# Altium schematic sheet ControlPlateSTM32.SchDoc
size A4; SheetNumber: 1; SheetTotal: 1
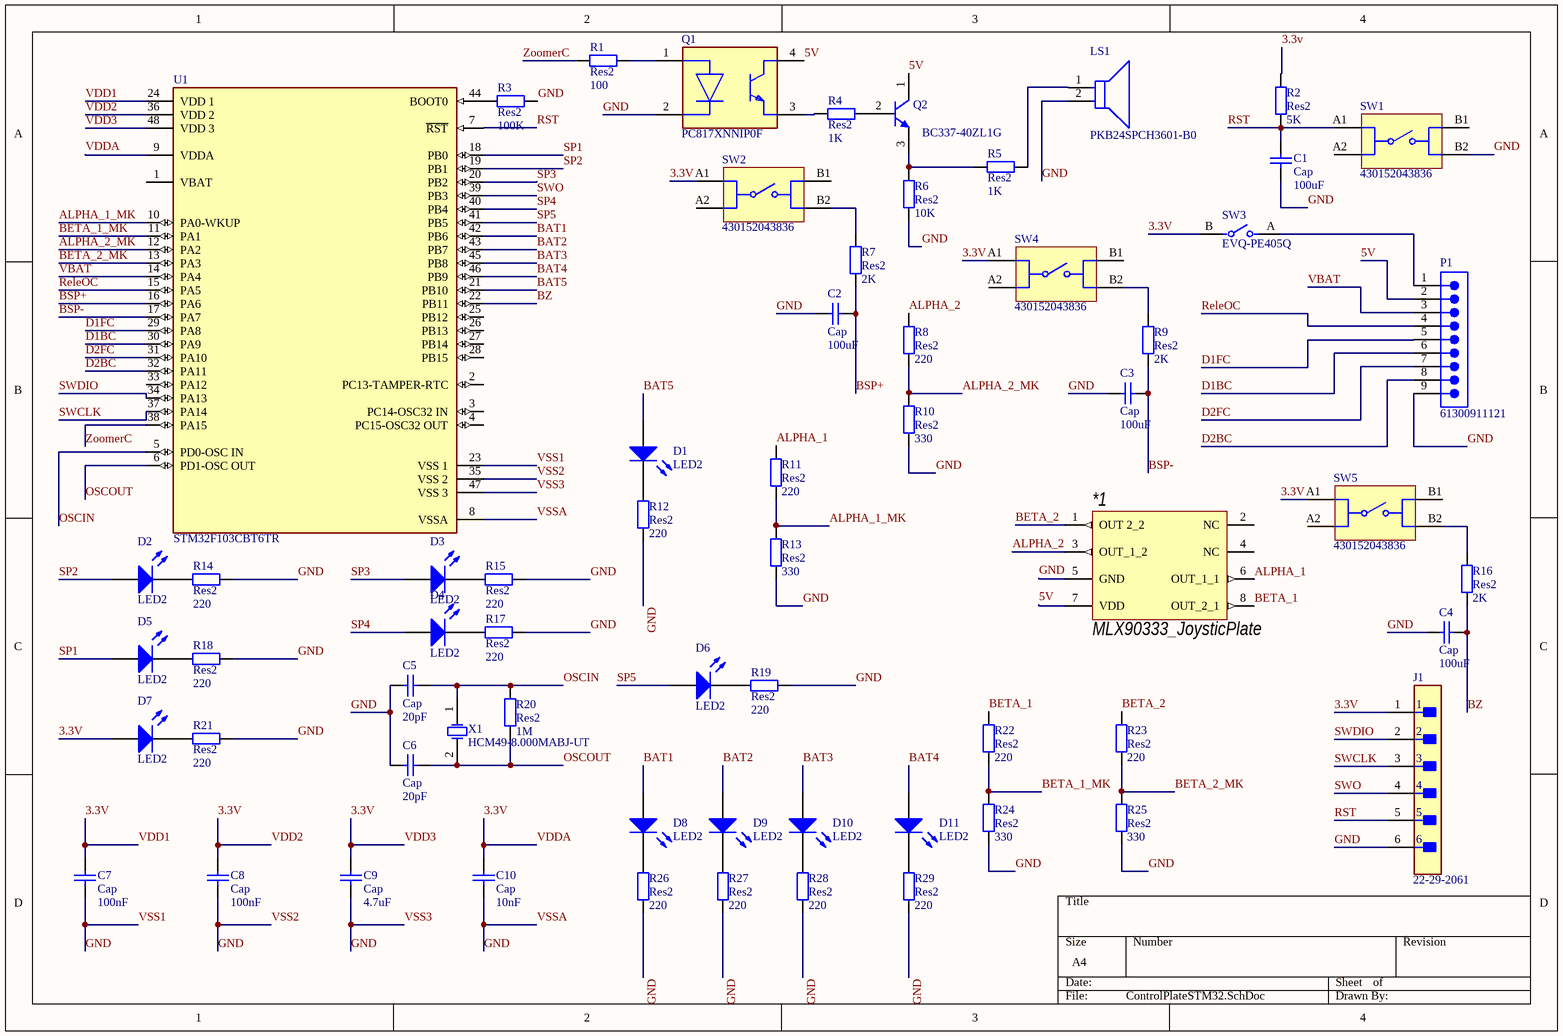
[diagram p0: ControlPlateSTM32.SchDoc]

## Parts
*1  MLX90333_JoysticPlate  [MLX90333_Joy]
C1  Cap  value 100uF  [RAD-0.3]
C2  Cap  value 100uF  [RAD-0.3]
C3  Cap  value 100uF  [RAD-0.3]
C4  Cap  value 100uF  [RAD-0.3]
C5  Cap  value 20pF  [RAD-0.3]
C6  Cap  value 20pF  [RAD-0.3]
C7  Cap  value 100nF  [RAD-0.3]
C8  Cap  value 100nF  [RAD-0.3]
C9  Cap  value 4.7uF  [RAD-0.3]
C10  Cap  value 10nF  [RAD-0.3]
D1  LED2  [3.2X1.6X1.1]
D2  LED2  [3.2X1.6X1.1]
D3  LED2  [3.2X1.6X1.1]
D4  LED2  [3.2X1.6X1.1]
D5  LED2  [3.2X1.6X1.1]
D6  LED2  [3.2X1.6X1.1]
D7  LED2  [3.2X1.6X1.1]
D8  LED2  [3.2X1.6X1.1]
D9  LED2  [3.2X1.6X1.1]
D10  LED2  [3.2X1.6X1.1]
D11  LED2  [3.2X1.6X1.1]
J1  22-29-2061  [FP-22-29-2061-MFG]
LS1  PKB24SPCH3601-B0  [FP-PKB24SPCH3601-B0-MFG]
P1  61300911121  [61300911121]
Q1  PC817XNNIP0F  [FP-PC817XNNIP0F-MFG]
Q2  BC337-40ZL1G  [ONSC-TO-92-3-29-11_AM_BL]
R1  Res2  value 100  [AXIAL-0.4]
R2  Res2  value 5K  [AXIAL-0.4]
R3  Res2  value 100K  [AXIAL-0.4]
R4  Res2  value 1K  [AXIAL-0.4]
R5  Res2  value 1K  [AXIAL-0.4]
R6  Res2  value 10K  [AXIAL-0.4]
R7  Res2  value 2K  [AXIAL-0.4]
R8  Res2  value 220  [AXIAL-0.4]
R9  Res2  value 2K  [AXIAL-0.4]
R10  Res2  value 330  [AXIAL-0.4]
R11  Res2  value 220  [AXIAL-0.4]
R12  Res2  value 220  [AXIAL-0.4]
R13  Res2  value 330  [AXIAL-0.4]
R14  Res2  value 220  [AXIAL-0.4]
R15  Res2  value 220  [AXIAL-0.4]
R16  Res2  value 2K  [AXIAL-0.4]
R17  Res2  value 220  [AXIAL-0.4]
R18  Res2  value 220  [AXIAL-0.4]
R19  Res2  value 220  [AXIAL-0.4]
R20  Res2  value 1M  [AXIAL-0.4]
R21  Res2  value 220  [AXIAL-0.4]
R22  Res2  value 220  [AXIAL-0.4]
R23  Res2  value 220  [AXIAL-0.4]
R24  Res2  value 330  [AXIAL-0.4]
R25  Res2  value 330  [AXIAL-0.4]
R26  Res2  value 220  [AXIAL-0.4]
R27  Res2  value 220  [AXIAL-0.4]
R28  Res2  value 220  [AXIAL-0.4]
R29  Res2  value 220  [AXIAL-0.4]
SW1  430152043836  [WS-TASV_L6W6H4.3_4301x20438x6]
SW2  430152043836  [WS-TASV_L6W6H4.3_4301x20438x6]
SW3  EVQ-PE405Q  [FP-EVQ-PE405Q-MFG]
SW4  430152043836  [WS-TASV_L6W6H4.3_4301x20438x6]
SW5  430152043836  [WS-TASV_L6W6H4.3_4301x20438x6]
U1  STM32F103CBT6TR  [FP-LQFP48-5B-MFG]
X1  HCM49-8.000MABJ-UT  [CFM-HCM49-2_V]

## Nets
3.3V: C7.2 C8.2 C9.2 C10.2 D7.1(A) J1.1 R2.1 SW2.A1 SW3.B SW4.A1 SW5.A1 U1.9(VDDA) U1.24(VDD_1) U1.36(VDD_2) U1.48(VDD_3)  [also labelled VDD1, VDD2, VDD3, VDDA]
5V: *1.7(VDD) P1.2 Q1.4(C) Q2.1(C)
ALPHA_1: *1.6(OUT_1_1) R11.2
ALPHA_1_MK: R11.1 R13.2 U1.10(PA0-WKUP)
ALPHA_2: *1.3(OUT_1_2) R8.2
ALPHA_2_MK: R8.1 R10.2 U1.12(PA2)
BAT1: D8.1(A) U1.42(PB6)
BAT2: D9.1(A) U1.43(PB7)
BAT3: D10.1(A) U1.45(PB8)
BAT4: D11.1(A) U1.46(PB9)
BAT5: D1.1(A) U1.21(PB10)
BETA_1: *1.8(OUT_2_1) R22.2
BETA_1_MK: R22.1 R24.2 U1.11(PA1)
BETA_2: *1.1(OUT_2_2) R23.2
BETA_2_MK: R23.1 R25.2 U1.13(PA3)
BSP+: C2.1 R7.2 U1.16(PA6)
BSP-: C3.1 R9.2 U1.17(PA7)
BZ: C4.1 R16.2 U1.22(PB11)
D1BC: P1.6 U1.30(PA9)
D1FC: P1.5 U1.29(PA8)
D2BC: P1.8 U1.32(PA11)
D2FC: P1.7 U1.31(PA10)
GND: *1.5(GND) C1.1 C2.2 C3.2 C4.2 C5.2 C6.2 C7.1 C8.1 C9.1 C10.1 J1.6 LS1.2(A) P1.9 Q1.2(C) R3.1 R6.2 R10.1 R12.1 R13.1 R14.1 R15.1 R17.1 R18.1 R19.1 R21.1 R24.1 R25.1 R26.1 R27.1 R28.1 R29.1 SW1.B2 U1.8(VSSA) U1.23(VSS_1) U1.35(VSS_2) U1.47(VSS_3)  [also labelled VSS1, VSS2, VSS3, VSSA]
OSCIN: C5.1 R20.1 U1.5(PD0-OSC_IN) X1.1(X1)
OSCOUT: C6.1 R20.2 U1.6(PD1-OSC_OUT) X1.2(X2)
ReleOC: P1.4 U1.15(PA5)
RST: C1.2 J1.5 R2.2 SW1.A1 U1.7(~{RST})
SP1: D5.1(A) U1.18(PB0)
SP2: D2.1(A) U1.19(PB1)
SP3: D3.1(A) U1.20(PB2)
SP4: D4.1(A) U1.40(PB4)
SP5: D6.1(A) U1.41(PB5)
SWCLK: J1.3 U1.37(PA14)
SWDIO: J1.2 U1.34(PA13)
SWO: J1.4 U1.39(PB3)
VBAT: P1.3 U1.14(PA4)
ZoomerC: R1.1 U1.38(PA15)
NetD1_2: D1.2(K) R12.2
NetD2_2: D2.2(K) R14.2
NetD3_2: D3.2(K) R15.2
NetD4_2: D4.2(K) R17.2
NetD5_2: D5.2(K) R18.2
NetD6_2: D6.2(K) R19.2
NetD7_2: D7.2(K) R21.2
NetD8_2: D8.2(K) R26.2
NetD9_2: D9.2(K) R27.2
NetD10_2: D10.2(K) R28.2
NetD11_2: D11.2(K) R29.2
NetLS1_1: LS1.1(C) R5.1
NetP1_1: P1.1 SW3.A
NetQ1_1: Q1.1(A) R1.2
NetQ1_3: Q1.3(E) R4.1
NetQ2_2: Q2.2(B) R4.2
NetQ2_3: Q2.3(E) R5.2 R6.1
NetR3_2: R3.2 U1.44(BOOT0)
NetR7_1: R7.1 SW2.B2
NetR9_1: R9.1 SW4.B2
NetR16_1: R16.1 SW5.B2

Not connected (* = marked no-connect by the designer): *1 2(NC) 4(NC); SW1 A2 B1; SW2 A2 B1; SW4 A2 B1; SW5 A2 B1; U1 1(VBAT) 2(PC13-TAMPER-RTC) 3(PC14-OSC32_IN) 4(PC15-OSC32_OUT) 25(PB12) 26(PB13) 27(PB14) 28(PB15) 33(PA12)

## Library data of the parts
C1-C10 = Cap: Capacitor; Published: 8-Jun-2000; LatestRevisionDate: 17-Jul-2002; LatestRevisionNote: Re-released for DXP Platform.; PackageReference: RAD-0.3; Publisher: Altium Limited; PackageDescription: Radial Cap, Thru-Hole; 2 Leads; 0.3 in Pin Spacing
D1-D11 = LED2: Typical RED, GREEN, YELLOW, AMBER GaAs LED; Published: 8-Jun-2000; LatestRevisionDate: 17-Jul-2002; LatestRevisionNote: Re-released for DXP Platform.; PackageVersion: Feb-2002; PackageReference: 3.2X1.6X1.1; Publisher: Altium Limited; PackageDescription: SM LED; 2 Flat Leads
J1 = CMP-04776-000348-1: CONN HEADER VERT 6POS 2.54MM; Gender: Male; Number of Poles: 6; Voltage Rating: 250V; Insulation Resistance: 50GR; Contact Resistance: 10mR; Current Rating: 4A; Number of Lines: 1; Height: 11.7mm; Mount: Through Hole; Length: 15.24mm; Contact Plating: Gold; Contact Type: Male Pin; Contact Material: Brass; Housing Material: Nylon; Series: KK® 6410; Number of Positions: 6; Contact Mating Length: 0.295inch; Fastening Type: Friction; RoHS Compliant: Yes; Color: Natural; Max Operating Temperature: 75°C; Contact Gender: Male; Packaging: Bulk; Termination: Solder; Voltage Rating (DC): 250V; Orientation: Straight; Radiation Hardening: No; Flammability Rating: UL94 V-0; Package Quantity: 1000; Housing Color: White; Number of Rows: 1; Min Operating Temperature: 0°C; Max Current Rating: 4A; Pitch: 2.54mm; Depth: 5.8mm; Number of Contacts: 6; Lead Free: Lead Free
LS1 = CMP-06203-000001-2: AUDIO PIEZO TRANSDUCER 3-15V TH; Self Resonant Frequency: 3.6kHz; Voltage Rating (DC): 15V; Min Supply Voltage: 3V; Operating Supply Current: 16mA; Voltage Rating: 12V; Max Frequency: 4.1kHz; Washable: No; REACH SVHC: No SVHC; Packaging: Bulk; Frequency: 3.6kHz; Max Operating Temperature: 70°C; Max Supply Voltage: 15V; Max Supply Voltage (DC): 15V; Diameter: 24.3mm; Lead Free: Lead Free; Radiation Hardening: No; Nominal Supply Current: 16mA; Height: 9.7mm; Mount: Flush; Nominal Supply Voltage (DC): 12V; Min Operating Temperature: -20°C; Termination: PC Pins; Length: 24.3mm; Package Quantity: 650; Min Supply Voltage (DC): 3V; Max Supply Current: 16mA
P1 = CMP-1502-01080-2: NexarPartId: 32855536; Number of Contacts: 9; Current Rating: 3A; Operating Supply Voltage: 250V; Connector Type: Male Pin; Gender: Male; Contact Resistance: 20mΩ; Pitch: 2.54mm; Number of Rows: 1; Number of Pins: 9; Termination: Solder; REACH SVHC: Unknown; Orientation: Vertical; Contact Plating: Gold; Mount: Through Hole; RoHS: Compliant; Number of Positions: 9; Color: Black; Lead Pitch: 2.54mm; Packaging: Bulk; Contact Mating Length: 5.9944mm; Contact Material: Copper
Q1 = CMP-65434-000005-1: OPTOISOLATOR 5KV TRANS 4SMD; Reverse Breakdown Voltage: 6V; Output Current per Channel: 30mA; Power Dissipation: 200mW; Collector-emitter Voltage-Max: 200mV; Max Output Voltage: 80V; Input Current: 50mA; Forward Voltage: 1.4V; Fall Time: 18000ns; Number of Elements: 1; Input Type: DC; Packaging: Tape and Reel; RoHS Compliant: Yes; Contact Plating: Copper; Min Operating Temperature: -30°C; Collector Emitter Saturation Voltage: 200mV; Max Input Current: 50mA; Radiation Hardening: No; Max Collector Current: 50mA; Case/Package: SMD/SMT; Mount: Surface Mount; Output Voltage: 80V; Forward Current: 50mA; Max Power Dissipation: 200mW; Collector Emitter Voltage (VCEO): 80V; Number of Channels: 1; Rise Time: 18000ns; Isolation Voltage: 5kV; Number of Pins: 4; Lead Free: Lead Free; Package Quantity: 2000; Isolation Voltage-Max: 5kV; Max Operating Temperature: 100°C
Q2 = CMP-1048-01583-1: Amplifier Transistor, NPN Silicon, 3-Pin TO-92, Pb-Free, Ammo Box; Manufacturer: On Semiconductor; IC Continuous (A): 0.8; ComponentLink2URL: http://www.onsemi.com/pub_link/Collateral/BC337-D.PDF; PackageReference: TO-92-3-29-11_AM_BL; ComponentLink1Description: Manufacturer URL; PartNumber: BC337-40ZL1G; RoHS: TRUE; PackageVersion: Rev. AM; ComponentLink3URL: http://www.onsemi.com/pub_link/Collateral/MAC97-D.PDF; ComponentLink3Description: Package Specification; Packing: Ammo Box; DatasheetVersion: Rev. 8; Polarity: NPN; ComponentLink1URL: http://www.onsemi.com/; ComponentLink2Description: Datasheet; PackageDescription: 3-Pin Transistor Outline, Body 4.825 x 3.685 mm, Pitch 1.27 mm; Mounting Technology: Through Hole
R1-R29 = Res2: Resistor; Published: 8-Jun-2000; LatestRevisionDate: 17-Jul-2002; LatestRevisionNote: Re-released for DXP Platform.; PackageReference: AXIAL-0.4; Publisher: Altium Limited; PackageDescription: Axial Device, Thru-Hole; 2 Leads; 0.4 in Pin Spacing
SW1 SW2 SW4 SW5 = CMP-1452-00002-2: NexarPartId: 22861785; Voltage Rating: 12V; Current Rating: 50mA; Switch Travel: 250µm; Switch Function: Off-Mom; Actuator Material: Liquid Crystal Polymer, Polymer; Insulation Resistance: 100MΩ; Actuator Length: 900µm; Throw Configuration: SPST; Mechanical Life: 200kcycles; Illumination Type: Illuminated, Non-Illuminated; Mount: Surface Mount; Max Operating Temperature: 85°C; Height: 4.3mm; RoHS: Compliant; Length: 6.2mm; Color: Orange; Width: 6.2mm; Contact Current Rating: 50mA; Diameter: 3.5mm; Termination: Gull Wing; Packaging: Tape and Reel; REACH SVHC: No SVHC; Contact Plating: Silver; Min Operating Temperature: -40°C; Contact Material: Stainless Steel, Steel
SW3 = CMP-05618-000107-1: SWITCH TACTILE SPST-NO 0.05A 12V; Mechanical Life: 50000Cycles; Actuator Type: Standard; Actuator Color: Grey; Contact Current Rating: 50mA; Switch Function: Off-Mom; Switch Travel: 0.25mm; Actuator Length: 1.5mm; Operating Force: 1N; Illumination Type: Non-Illuminated; Throw Configuration: SPST; Contact Resistance: 100mR; Mount: Through Hole; Contact Plating: Silver; Max Operating Temperature: 85°C; Max Voltage Rating (DC): 12V; Electrical Life: 50000Cycles; Current Rating: 50mA; Series: EVQPE; Length: 6mm; Size: 3.5mm; Packaging: Bulk; Termination: PC Pin; Min Operating Temperature: -30°C; Lead Free: Lead Free; Height: 5mm; Voltage Rating (DC): 12V; REACH SVHC: No SVHC; Width: 3.5mm; Package Quantity: 1000; Depth: 7.9mm; Max Current Rating: 50mA; Orientation: Straight
U1 = CMP-0237-00247-4: NexarPartId: 12442975; Number of Channels: 10; Oscillator Type: Internal; Max Power Dissipation: 363mW; Number of PWM Channels: 4; Number of UART Channels: 3; RAM Size: 20kB; Frequency: 72MHz; Number of A/D Converters: 2; Memory Type: FLASH; Watchdog Timer: Yes; Data Bus Width: 32b; Number of Programmable I/O: 37; Peripherals: DMA, I2C, POR, PWM, Temp Sensor, WDT; Interface: CAN, I2C, IrDA, LIN, SPI, USART, USB; Number of USB Channels: 1; Flash Memory Size: 128kB; Core Architecture: ARM; Max Junction Temperature (Tj): 105°C; Min Supply Voltage: 2V; Nominal Supply Current: 1.7µA; Max Supply Voltage: 3.6V; Case/Package: LQFP; Length: 7mm; Min Operating Temperature: -40°C; Schedule B: 8542310000; Number of USART Channels: 3; Lead Free: Lead Free; Lifecycle Status: Production; RoHS: Compliant; Packaging: Tape & Reel (TR); Ambient Temperature Range High: 105°C; Max Operating Temperature: 85°C; Max Frequency: 72MHz; Number of SPI Channels: 2; Memory Size: 128kB; Number of Timers/Counters: 4; Radiation Hardening: No; Number of I/Os: 37; Number of Pins: 48; Number of I2C Channels: 2; Height: 1.6mm; Number of ADC Channels: 10
X1 = CMP-1215-00001-1: At-Cut Crystal Unit, 3.5 to 30 MHz, -40 to 85 degC, 2-Pin 11.4Ã—4.7Ã—4.3 mm SMD, RoHS, Reel; Manufacturer: Citizen Finetech Miyota; DL: 100 uW; C0: 7 pF Max.; R1: 50 to 200 Ohm; IR: 500 MOhm Min.; f0: 3.5 to 30 MHz; Mounting Technology: Surface Mount; Packing: Reel; ComponentLink2URL: http://cfm.citizen.co.jp/english/product/pdf/HCM49.pdf; PartNumber: HCM49-8.000MABJ-UT; Operating Temperature: -40 to 85 degC; ComponentLink3URL: http://cfm.citizen.co.jp/english/product/pdf/HCM49.pdf; ComponentLink2Description: Datasheet; ComponentLink3Description: Package Specification; ComponentLink1Description: Manufacturer URL; PackageDescription: 2-Pin Surface Mount, Body 11.4 x 4.7 mm, Pitch 8.5 mm; DatasheetVersion: Jan-12; RoHS: TRUE; ComponentLink1URL: http://cfm.citizen.co.jp/english/index.html